# EAGLE design IN17BOARD (EAGLE 7.1.0)
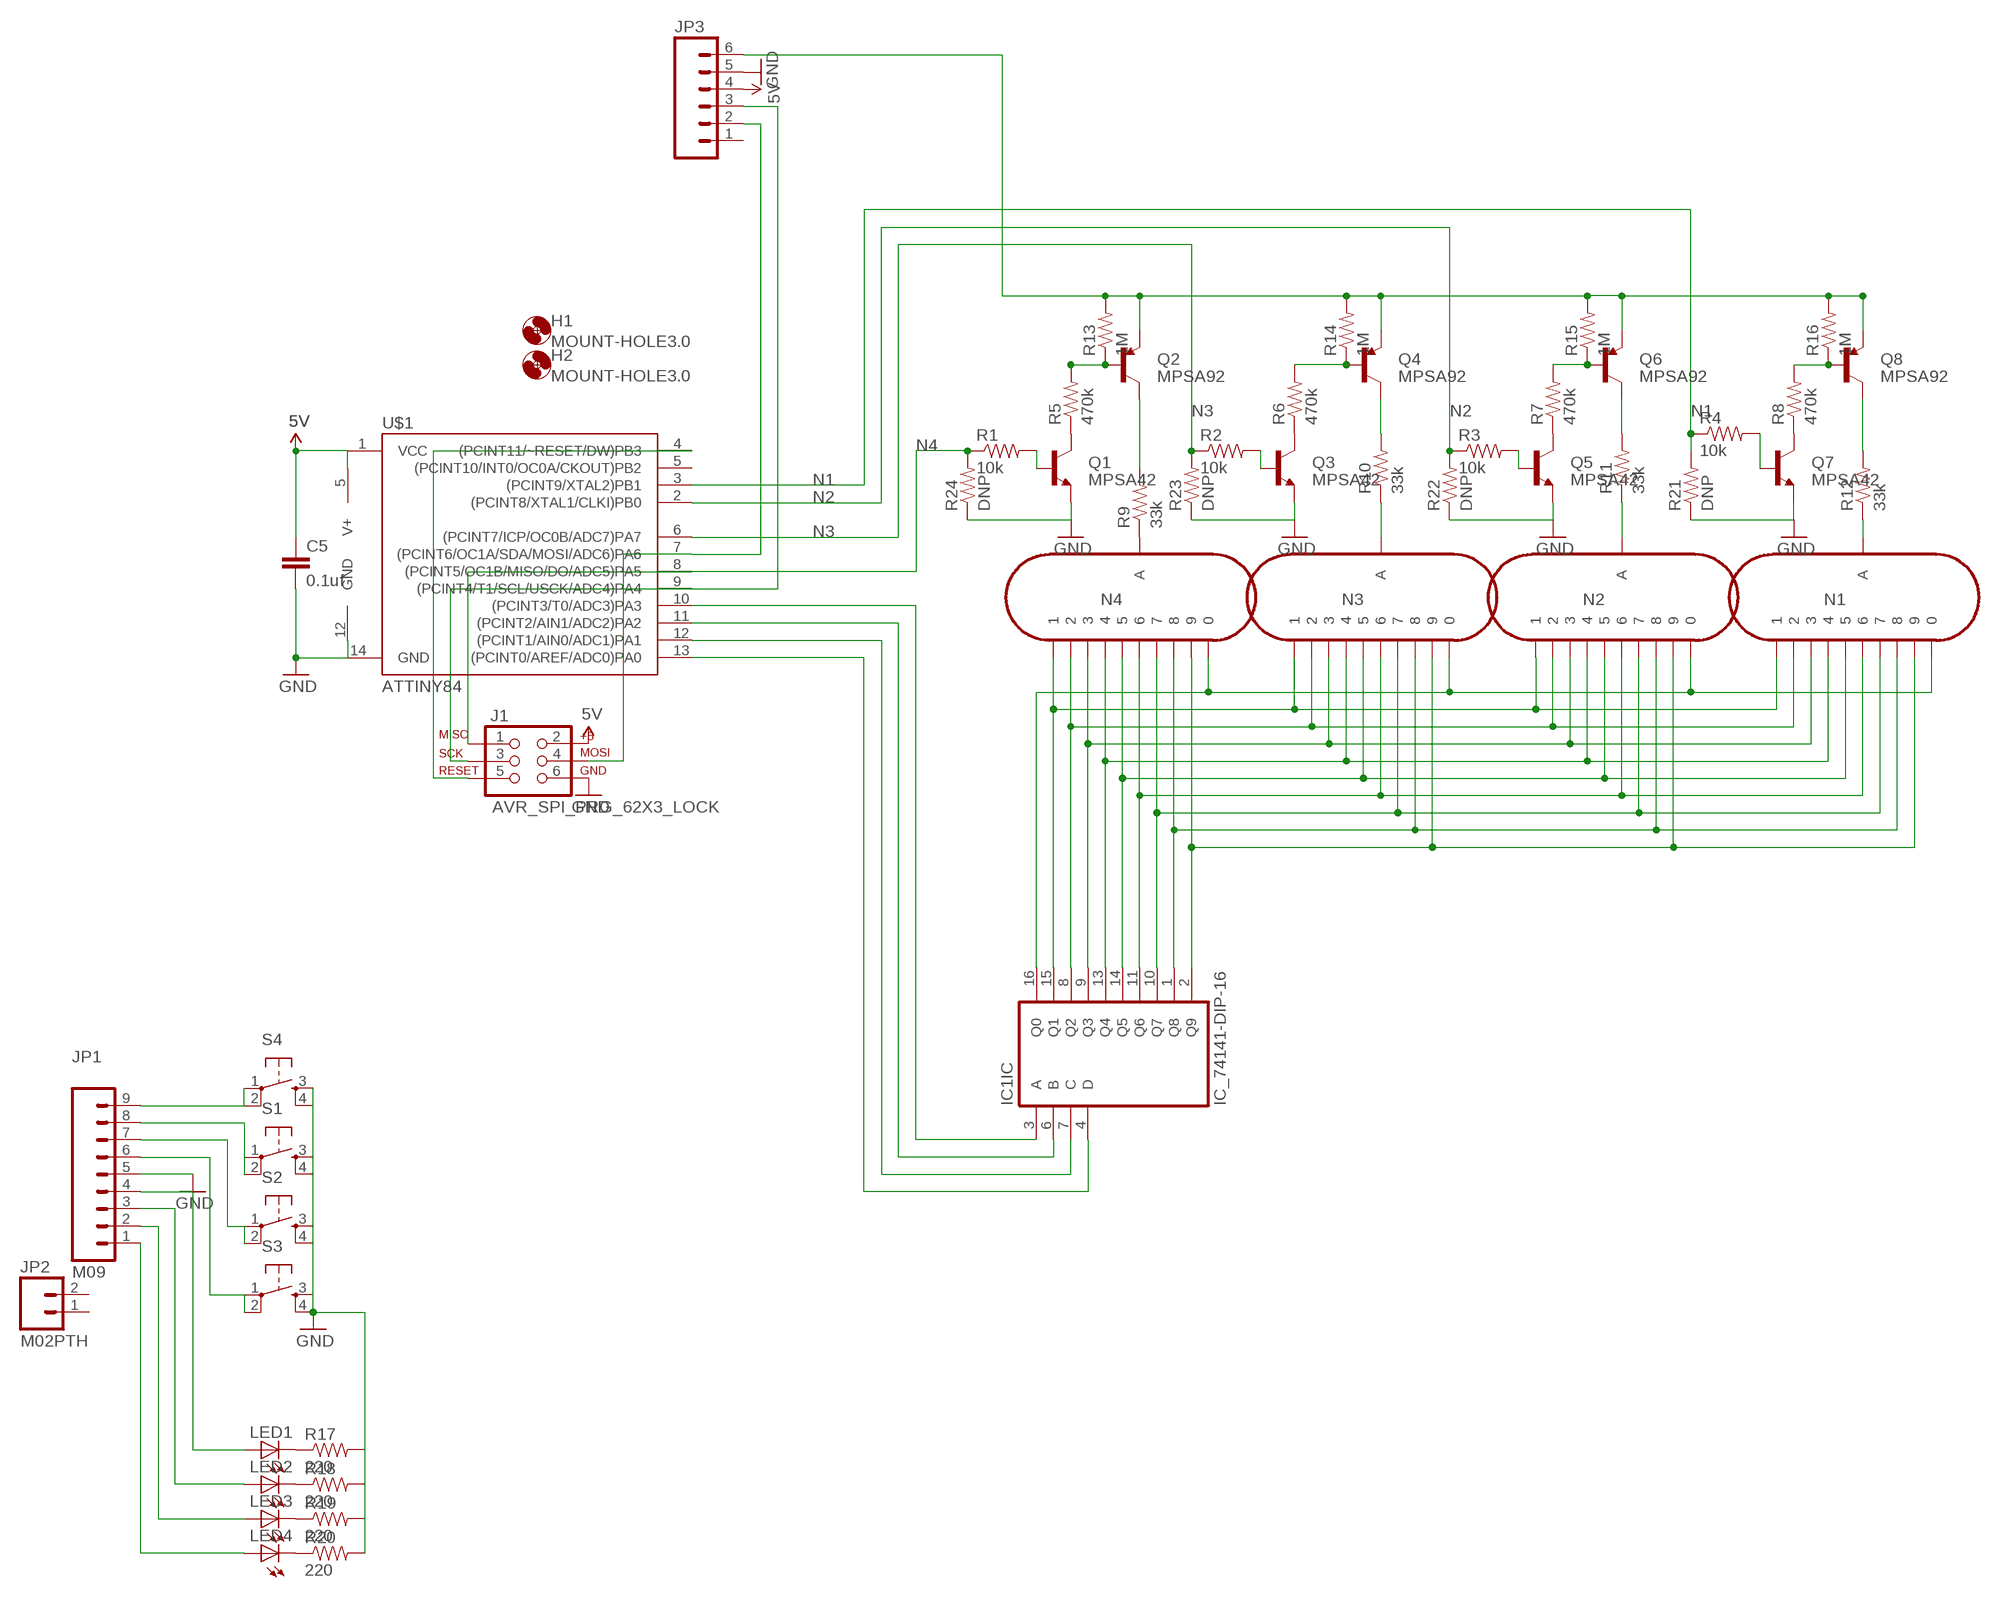
[diagram p0: schematic, sheet 1]

## Parts
C5  0.1uf  CAP0805  [0805]
H1  MOUNT-HOLE3.0  [3,0]
H2  MOUNT-HOLE3.0  [3,0]
IC1  IC_74141-DIP-16  [DIL16]
J1  AVR_SPI_PRG_62X3_LOCK  [2X3_LOCK]
JP1  M09  [1X09]
JP2  M02PTH  [1X02]
JP3  M06SIP  [1X06]
LED1  LED0603  [LED-0603]
LED2  LED0603  [LED-0603]
LED3  LED0603  [LED-0603]
LED4  LED0603  [LED-0603]
N1  IN-17  [IN-17]
N2  IN-17  [IN-17]
N3  IN-17  [IN-17]
N4  IN-17  [IN-17]
Q1  MPSA42  TRANSISTOR_NPNMPSA42  [SOT23]
Q2  MPSA92  TRANSISTOR_PNPMMBT3906  [SOT23]
Q3  MPSA42  TRANSISTOR_NPNMPSA42  [SOT23]
Q4  MPSA92  TRANSISTOR_PNPMMBT3906  [SOT23]
Q5  MPSA42  TRANSISTOR_NPNMPSA42  [SOT23]
Q6  MPSA92  TRANSISTOR_PNPMMBT3906  [SOT23]
Q7  MPSA42  TRANSISTOR_NPNMPSA42  [SOT23]
Q8  MPSA92  TRANSISTOR_PNPMMBT3906  [SOT23]
R1  10k  RESISTOR0805-RES  [0805]
R2  10k  RESISTOR0805-RES  [0805]
R3  10k  RESISTOR0805-RES  [0805]
R4  10k  RESISTOR0805-RES  [0805]
R5  470k  RESISTOR0805-RES  [0805]
R6  470k  RESISTOR0805-RES  [0805]
R7  470k  RESISTOR0805-RES  [0805]
R8  470k  RESISTOR0805-RES  [0805]
R9  33k  RESISTOR0805-RES  [0805]
R10  33k  RESISTOR0805-RES  [0805]
R11  33k  RESISTOR0805-RES  [0805]
R12  33k  RESISTOR0805-RES  [0805]
R13  1M  RESISTOR0805-RES  [0805]
R14  1M  RESISTOR0805-RES  [0805]
R15  1M  RESISTOR0805-RES  [0805]
R16  1M  RESISTOR0805-RES  [0805]
R17  220  RESISTOR0603-RES  [0603-RES]
R18  220  RESISTOR0603-RES  [0603-RES]
R19  220  RESISTOR0603-RES  [0603-RES]
R20  220  RESISTOR0603-RES  [0603-RES]
R21  DNP  RESISTOR0805-RES  [0805]
R22  DNP  RESISTOR0805-RES  [0805]
R23  DNP  RESISTOR0805-RES  [0805]
R24  DNP  RESISTOR0805-RES  [0805]
S1  TAC_SWITCHPTH  [TACTILE-PTH]
S2  TAC_SWITCHPTH  [TACTILE-PTH]
S3  TAC_SWITCHPTH  [TACTILE-PTH]
S4  TAC_SWITCHPTH  [TACTILE-PTH]
U$1  ATTINY84  [SO14]

## Nets
0: IC1.16(IC:Q0) N1.0 N2.0 N3.0 N4.0
1: IC1.15(IC:Q1) N1.1 N2.1 N3.1 N4.1
2: IC1.8(IC:Q2) N1.2 N2.2 N3.2 N4.2
3: IC1.9(IC:Q3) N1.3 N2.3 N3.3 N4.3
4: IC1.13(IC:Q4) N1.4 N2.4 N3.4 N4.4
5: IC1.14(IC:Q5) N1.5 N2.5 N3.5 N4.5
5V: C5.1 IC1.5(SUPPLY:V+) J1.2 JP3.4 U$1.1(VCC)
6: IC1.11(IC:Q6) N1.6 N2.6 N3.6 N4.6
7: IC1.10(IC:Q7) N1.7 N2.7 N3.7 N4.7
8: IC1.1(IC:Q8) N1.8 N2.8 N3.8 N4.8
9: IC1.2(IC:Q9) N1.9 N2.9 N3.9 N4.9
A: IC1.3(IC:A) U$1.10((PCINT3/T0/ADC3)PA3)
B: IC1.6(IC:B) U$1.11((PCINT2/AIN1/ADC2)PA2)
C: IC1.7(IC:C) U$1.12((PCINT1/AIN0/ADC1)PA1)
D: IC1.4(IC:D) U$1.13((PCINT0/AREF/ADC0)PA0)
GND: C5.2 IC1.12(SUPPLY:GND) J1.6 JP1.5 JP3.5 Q1.2(E) Q3.2(E) Q5.2(E) Q7.2(E) R17.2 R18.2 R19.2 R20.2 R21.1 R22.1 R23.1 R24.1 S1.3 S1.4 S2.3 S2.4 S3.3 S3.4 S4.3 S4.4 U$1.14(GND)
N1: R4.1 R21.2 U$1.3((PCINT9/XTAL2)PB1)
N2: R3.1 R22.2 U$1.2((PCINT8/XTAL1/CLKI)PB0)
N3: R2.1 R23.2 U$1.6((PCINT7/ICP/OC0B/ADC7)PA7)
N4: J1.1 R1.1 R24.2 U$1.8((PCINT5/OC1B/MISO/DO/ADC5)PA5)
N$3: J1.5 U$1.4((PCINT11/~RESET/DW)PB3)
N$11: Q1.1(B) R1.2
N$12: Q3.1(B) R2.2
N$13: Q5.1(B) R3.2
N$14: Q7.1(B) R4.2
N$15: Q1.3(C) R5.1
N$16: Q3.3(C) R6.1
N$17: Q5.3(C) R7.1
N$18: Q7.3(C) R8.1
N$19: Q2.1(B) R5.2 R13.1
N$20: Q4.1(B) R6.2 R14.1
N$21: Q6.1(B) R7.2 R15.1
N$22: Q8.1(B) R8.2 R16.1
N$23: JP3.6 Q2.2(E) Q4.2(E) Q6.2(E) Q8.2(E) R13.2 R14.2 R15.2 R16.2
N$24: N4.A R9.1
N$25: N3.A R10.1
N$26: N2.A R11.1
N$27: N1.A R12.1
N$28: Q2.3(C) R9.2
N$29: Q4.3(C) R10.2
N$30: Q6.3(C) R11.2
N$31: Q8.3(C) R12.2
N$42: LED1.C R17.1
N$43: LED2.C R18.1
N$44: LED3.C R19.1
N$45: JP1.9 S4.1 S4.2
N$46: JP1.8 S1.1 S1.2
N$47: JP1.7 S2.1 S2.2
N$48: JP1.6 S3.2
N$49: LED4.C R20.1
N$50: JP1.4 LED1.A
N$51: JP1.3 LED2.A
N$52: JP1.2 LED3.A
N$53: JP1.1 LED4.A
SCL: J1.3 JP3.3 U$1.9((PCINT4/T1/SCL/USCK/ADC4)PA4)
SDA: J1.4 JP3.2 U$1.7((PCINT6/OC1A/SDA/MOSI/ADC6)PA6)
Unconnected: JP2.1 JP2.2 JP3.1 S3.1 U$1.5((PCINT10/INT0/OC0A/CKOUT)PB2)

## Library data of the parts
C5 = SparkFun-Capacitors:CAP: Capacitor Standard 0603 ceramic capacitor, and 0.1" leaded capacitor.
H1 H2 = holes:MOUNT-HOLE: MOUNTING HOLE with drill center marker
IC1 = dp_devices:IC_74141: BCD to decimal decoder
J1 = SparkFun-Connectors:AVR_SPI_PRG_6: AVR ISP 6 Pin This is the reduced ISP connector for AVR programming. Common on Arduino. This footprint will take up less PCB space and can be used with a 10-pin to 6-pin adapter such as SKU: BOB-08508
JP1 = SparkFun-Connectors:M09: Header 9 Standard 9-pin 0.1" header. Use with straight break away headers (SKU : PRT-00116), right angle break away headers (PRT-00553), swiss pins (PRT-00743), machine pins (PRT-00117), and female headers (PRT-00115).
JP2 = SparkFun-Connectors:M02: Standard 2-pin 0.1" header. Use with - straight break away headers ( PRT-00116) - right angle break away headers (PRT-00553) - swiss pins (PRT-00743) - machine pins (PRT-00117) - female headers (PRT-00115) Molex polarized connector foot print use with: PRT-08233 with associated crimp pins and housings. 2.54_SCREWTERM for use with PRT-10571. 3.5mm Screw Terminal footprints for PRT-08084 5mm Screw Terminal footprints for use with PRT-08433
JP3 = SparkFun-Connectors:M06: Header 6 Standard 6-pin 0.1" header. Use with straight break away headers (SKU : PRT-00116), right angle break away headers (PRT-00553), swiss pins (PRT-00743), machine pins (PRT-00117), and female headers (PRT-00115). Molex polarized connector foot print use with SKU : PRT-08094 with associated crimp pins and housings. NOTES ON THE VARIANTS LOCK and LOCK_LONGPADS... This footprint was designed to help hold the alignment of a through-hole component (i.e. 6-pin header) while soldering it into place. You may notice that each hole has been shifted either up or down by 0.005 of an inch from it's more standard position (which is a perfectly straight line). This slight alteration caused the pins (the squares in the middle) to touch the edges of the holes. Because they are alternating, it causes a "brace" to hold the component in place. 0.005 has proven to be the perfect amount of "off-center" position when using our standard breakaway headers. Although looks a little odd when you look at the bare footprint, once you have a header in there, the alteration is very hard to notice. Also,if you push a header all the way into place, it is covered up entirely on the bottom side. This idea of altering the position of holes to aid alignment will be further integrated into the Sparkfun Library for other footprints. It can help hold any component with 3 or more connection pins.
LED1-LED4 = SparkFun-LED:LED: LEDs Standard schematic elements and footprints for 5mm, 3mm, 1206, and 0603 sized LEDs. 5mm - Spark Fun Electronics SKU : COM-00529 (and others)
N1-N4 = russian-nixies:IN-17: IN-17: tiny numeric topview nixie tube
Q1 Q3 Q5 Q7 = SparkFun-DiscreteSemi:TRANSISTOR_NPN: Generic NPN BJT MMBT2222A - TRANS-08049 (SOT-23, 1A 40V) MPSA42 - TRANS-09116 (SOT-23, 500mA 300V) MMBT5088LT1G - TRANS-11160 (SOT-23, 50 mA 30V); PROD_ID: TRANS-09116
Q2 Q4 Q6 Q8 = SparkFun-DiscreteSemi:TRANSISTOR_PNP: Generic PNP BJT Double check pinouts against datasheets- not all devices are the same! MMBT3906 - 40V 200mA SOT-23 (TRANS-08052) MMBT4403 - 40V 600mA SOT-23 (TRANS-09245); PROD_ID: TRANS-08052; VALUE: MMBT3906
R1-R24 = SparkFun-Resistors:RESISTOR: Resistor Basic schematic elements and footprints for 0603, 1206, and PTH resistors.
S1-S4 = SparkFun-Electromechanical:TAC_SWITCH: Momentary Switch Button commonly used for reset or general input. Spark Fun Electronics SKU : COM-00097 SMT- SWCH-08247
U$1 = SparkFun-DigitalIC:ATTINY84: Atmel 14-pin 2/4/8kB flash uC

## Net classes
0 default: width 0.254 mm

## Board
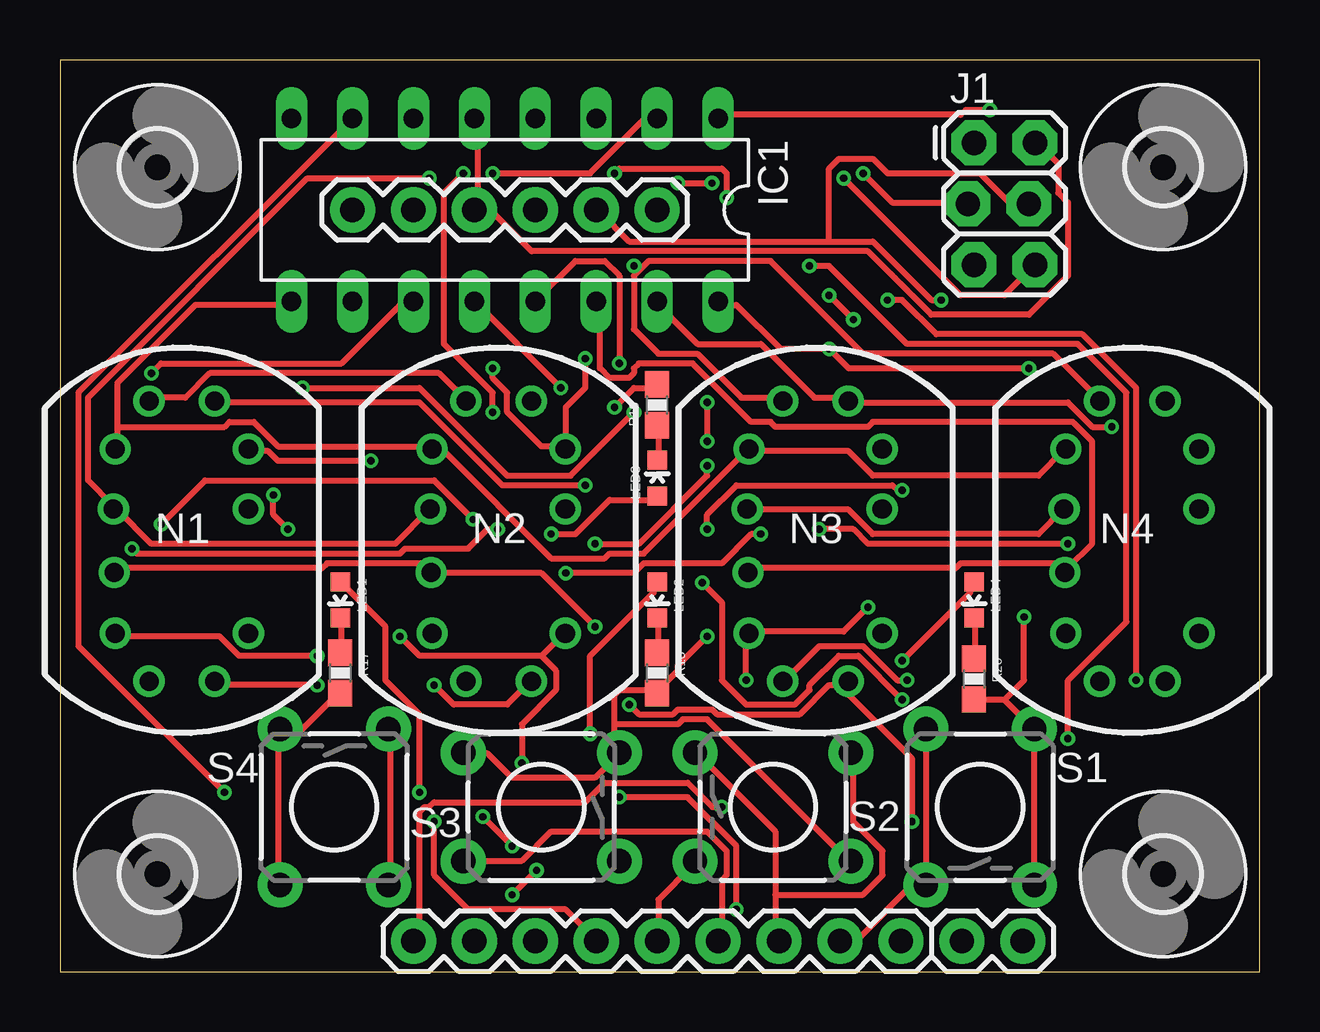
[diagram p1: board, top side]
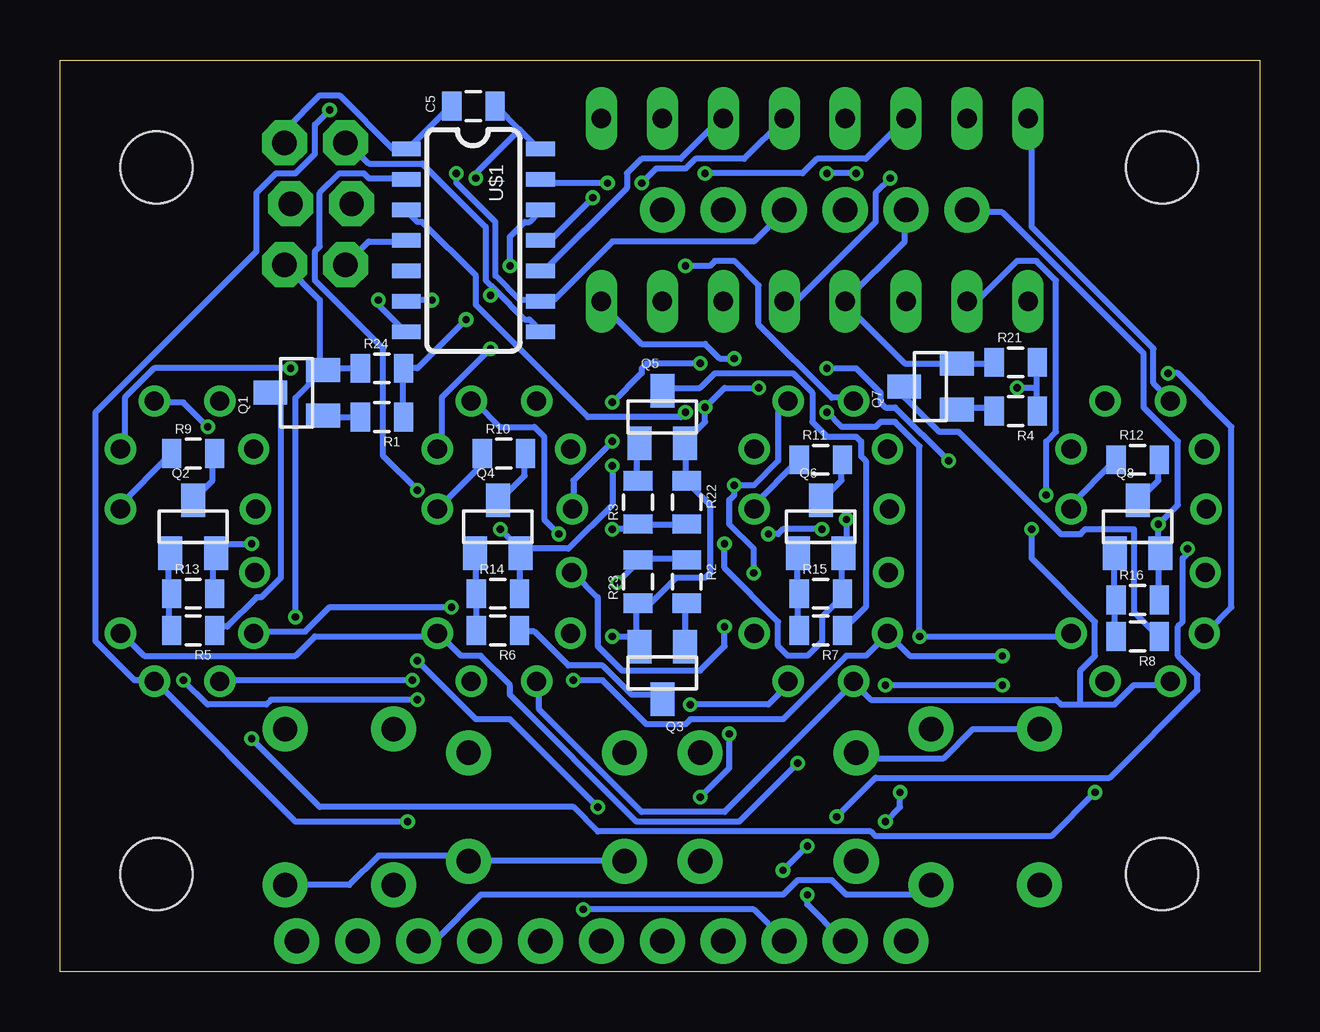
[diagram p2: board, bottom side, seen from below]

Size 50 x 38 mm. Coordinates in mm from the lower left corner, seen from the top.
Outline: 0,0 50,0 50,38 0,38 0,0
Copper layers (1*16): Top 0.035mm / dielectric 1.5mm / Bottom 0.035mm
Design rules "SeeedStudio_2layer_DRU_no_angle_20140221": minimum track width 6mil, minimum drill 12mil, track to track 6mil, track to pad 6mil, pad to pad 6mil, via to via 6mil, smd to smd 0mil, copper to edge 10mil, drill to drill 10mil, minimum pad ring 10mil, minimum via ring 6mil, stop-mask expansion 2mil, vias tented up to drill 100mil, thermal gap 10mil

### Footprints (pad centres in the part's own frame; a part is rotated, then mirrored left to right if it is on the bottom)
0805 = smd 0.8 x 1.2: 1 -0.9,0; 2 0.9,0
3,0 = hole 3: 0,0
DIL16 = drill 0.813 long: 1 -8.89,-3.81; 2 -6.35,-3.81; 3 -3.81,-3.81; 4 -1.27,-3.81; 5 1.27,-3.81; 6 3.81,-3.81; 7 6.35,-3.81; 8 8.89,-3.81; 9 8.89,3.81; 10 6.35,3.81; 11 3.81,3.81; 12 1.27,3.81; 13 -1.27,3.81; 14 -3.81,3.81; 15 -6.35,3.81; 16 -8.89,3.81
2X3_LOCK = drill 1.016 pad 1.88 octagon: 1 0,0; 2 0,2.54; 3 2.54,-0.254; 4 2.54,2.286; 5 5.08,0; 6 5.08,2.54
1X09 = drill 1.016 pad 1.88: 1 0,0; 2 2.54,0; 3 5.08,0; 4 7.62,0; 5 10.16,0; 6 12.7,0; 7 15.24,0; 8 17.78,0; 9 20.32,0
1X02 = drill 1.016 pad 1.88: 1 0,0; 2 2.54,0
1X06 = drill 1.016 pad 1.88: 1 0,0; 2 2.54,0; 3 5.08,0; 4 7.62,0; 5 10.16,0; 6 12.7,0
LED-0603 = smd 0.8 x 0.8: A 0,-0.75; C 0,0.75
IN-17 = drill 0.8: 0 2.777,4; 1 1.365,6; 2 -1.365,6; 3 -2.778,4; 4 -2.858,1.5; 5 -2.818,-1.143; 6 -2.778,-3.683; 7 -1.365,-5.683; 8 1.365,-5.683; 9 2.777,-3.683; A 2.777,1.5
SOT23 = smd 1 x 1.4: 1 -0.95,-1.1; 2 0.95,-1.1; 3 0,1.1
0603-RES = smd 1.1 x 1: 1 -0.85,0; 2 0.85,0
TACTILE-PTH = drill 1.016 pad 1.88: 1 -3.251,2.261; 2 3.251,2.261; 3 -3.251,-2.261; 4 3.251,-2.261
SO14 = smd 0.6 x 1.2: 1 -3.81,-2.8; 2 -2.54,-2.8; 3 -1.27,-2.8; 4 0,-2.8; 5 1.27,-2.8; 6 2.54,-2.8; 7 3.81,-2.8; 8 3.81,2.8; 9 2.54,2.8; 10 1.27,2.8; 11 0,2.8; 12 -1.27,2.8; 13 -2.54,2.8; 14 -3.81,2.8

### Placement (x,y rotation side)
C5  32.77,36.07 0 bottom
H1  4.06,33.53 0 top
H2  45.97,4.06 0 top
H3  MOUNT-HOLE3.0  [3,0]  4.06,4.06 0 top
H4  MOUNT-HOLE3.0  [3,0]  45.97,33.53 0 top
IC1  18.54,31.75 180 top
J1  38.1,34.54 270 top
JP1  14.73,1.27 0 top
JP2  37.59,1.27 0 top
JP3  24.89,31.75 180 top
LED1  11.68,15.49 180 top
LED2  24.89,15.49 180 top
LED3  24.89,20.57 0 top
LED4  38.1,15.49 180 top
N1  5.08,17.78 0 top
N2  18.29,17.78 0 top
N3  31.5,17.78 0 top
N4  44.7,17.78 0 top
Q1  40.13,24.13 90 bottom
Q2  44.45,18.54 0 bottom
Q3  24.89,12.45 180 bottom
Q4  31.75,18.54 0 bottom
Q5  24.89,23.11 0 bottom
Q6  18.29,18.54 0 bottom
Q7  13.72,24.38 90 bottom
Q8  5.08,18.54 0 bottom
R1  36.58,23.11 180 bottom
R2  23.88,16.26 270 bottom
R3  25.91,19.56 90 bottom
R4  10.16,23.37 180 bottom
R5  44.45,14.22 180 bottom
R6  31.75,14.22 180 bottom
R7  18.29,14.22 180 bottom
R8  5.08,13.97 180 bottom
R9  44.45,21.59 0 bottom
R10  31.5,21.59 0 bottom
R11  18.29,21.34 0 bottom
R12  5.08,21.34 0 bottom
R13  44.45,15.75 0 bottom
R14  31.75,15.75 0 bottom
R15  18.29,15.75 0 bottom
R16  5.08,15.49 0 bottom
R17  11.68,12.45 270 top
R18  24.89,12.45 270 top
R19  24.89,23.62 90 top
R20  38.1,12.19 270 top
R21  10.16,25.4 0 bottom
R22  23.88,19.56 270 bottom
R23  25.91,16.26 90 bottom
R24  36.58,25.15 0 bottom
S1  38.35,6.86 90 top
S2  29.72,6.86 0 top
S3  20.07,6.86 180 top
S4  11.43,6.86 270 top
U$1  32.77,30.48 270 bottom

### Tracks (layer width: path | path; a pad name or v marks a point on that pad's centre or on a via)
0  (via drill 0.3)
  Top 0.254: v12.95,21.29 9.09,21.29 8.69,21.69 7.87,21.69 N1.0 | v18.03,25.15 18.03,24.74 18.64,24.13 18.64,23.32 20.07,21.89 20.88,21.89 N2.0 21.08,21.89 21.08,23.52 21.89,24.33 v21.89,25.55 | IC1.16 27.58,27.79 28.19,27.79 30.02,25.96 v32.05,25.96 32.87,25.15 v40.39,25.15
  Bottom 0.254: v12.95,21.29 15.19,23.52 15.6,23.52 15.8,23.72 15.8,24.13 16.82,25.15 v18.03,25.15 | v32.05,25.96 34.09,23.93 34.09,21.89 N3.0 | v40.39,25.15 46.08,25.15 47.3,23.93 47.3,21.89 N4.0 | v21.89,25.55 22.5,25.55 23.11,26.16 25.76,26.16 27.38,27.79 IC1.16
1  (via drill 0.3)
  Top 0.254: v21.89,20.27 18.44,20.27 14.99,23.72 6.45,23.72 N1.1 | IC1.15 24.94,27.79 26.57,26.16 29.21,26.16 31.45,23.93 32.66,23.93 N3.1 32.87,23.72 42.01,23.72 43.03,22.71 v43.84,22.71 | v21.08,16.61 23.93,16.61 24.33,17.02 27.58,17.02 28.8,18.24 v29.21,18.24
  Bottom 0.254: N2.1 19.66,23.72 20.07,23.32 20.07,21.29 21.08,20.27 v21.89,20.27 21.89,19.86 22.1,19.66 22.1,18.64 21.08,17.63 v21.08,16.61 | v43.84,22.71 44.86,23.72 45.87,23.72 N4.1 | v29.21,18.24 29.82,18.85 29.82,22.3 30.23,22.71 31.65,22.71 32.66,23.72 N3.1
2  (via drill 0.3)
  Top 0.254: 24.13,29.21 24.54,29.62 29.62,29.62 33.48,25.76 41.4,25.76 43.23,23.93 N4.2 | 24.13,29.21 23.93,29.01 23.93,26.77 24.94,25.76 26.57,25.76 28.4,23.93 30.02,23.93 N3.2 | N1.2 3.81,23.93 5.23,23.93 6.25,24.94 15.8,24.94 16.82,23.93 N2.2 | v23.93,29.41 24.13,29.21
  Bottom 0.254: IC1.8 9.5,35.51 9.5,31.04 4.42,25.96 4.42,24.54 3.81,23.93 N1.2 | v23.93,29.41 22.91,29.41 22.71,29.62 21.89,29.62 20.88,28.6 20.88,26.98 17.83,23.93 17.02,23.93 N2.2
3
  Top 0.254: N4.3 41.81,21.69 40.79,20.68 33.88,20.68 32.87,21.69 28.8,21.69 N3.3 28.6,21.69 24.33,17.42 22.91,17.42 22.71,17.22 20.47,17.22 16,21.69 15.6,21.69 N2.3 15.39,21.89 9.09,21.89 8.08,22.91 7.06,22.91 6.86,22.71 2.39,22.71 | 2.39,22.71 2.39,24.54 5.64,27.79 9.5,27.79 IC1.9 | 2.39,22.71 2.39,21.89 N1.3
4  (via drill 0.3)
  Top 0.254: N3.4 28.8,19.25 32.87,19.25 33.88,18.24 40.79,18.24 41.81,19.25 N4.4 | N2.4 15.39,19.25 13.97,17.83 3.81,17.83 2.39,19.25 N1.4 2.18,19.46 1.17,20.47 1.17,23.93 10.31,33.07 v15.39,33.07 | v26.98,23.72 v26.98,22.1 | v23.32,25.35 23.32,29.01 22.71,29.62 21.49,29.62 IC1.13
  Bottom 0.254: v15.39,33.07 16,32.46 16,31.24 19.25,27.99 19.66,27.99 IC1.13 | v26.98,22.1 28.6,20.47 28.6,19.46 N3.4 | v26.98,23.72 25.76,24.94 25.76,25.15 25.55,25.35 v23.32,25.35
5  (via drill 0.3)
  Top 0.254: N1.5 2.39,16.82 10.92,16.82 11.12,17.02 15.19,17.02 15.39,16.82 N2.5 15.6,16.61 20.07,16.61 v22.3,14.38 | N3.5 28.8,16.82 37.34,16.82 37.54,17.02 41.6,17.02 41.81,16.82 N4.5 42.01,16.82 43.03,17.83 43.03,22.1 42.22,22.91 33.88,22.91 33.68,22.71 29.82,22.71 29.62,22.91 28.8,22.91 26.36,25.35 24.13,25.35 23.93,25.15 23.93,24.94 23.72,24.74 22.91,24.74 22.5,25.15 22.5,27.79 IC1.14
  Bottom 0.254: v22.3,14.38 22.3,13.56 23.32,12.55 26.57,12.55 27.58,13.56 27.58,15.6 28.6,16.61 N3.5
5V
  Top 0.254: IC1.5 17.42,35.51 17.42,31.85 JP3.4 17.42,31.65 18.03,31.65 19.66,30.02 33.68,30.02 36.32,27.38 40.39,27.38 42.01,29.01 42.01,32.05 41.6,32.46 41.6,33.68 40.79,34.49 J1.2
  Bottom 0.254: C5.1 33.68,36.12 35.51,34.29 U$1.1 36.12,34.29 38.35,36.52 39.17,36.52 40.59,35.1 40.59,34.7 J1.2
6  (via drill 0.3)
  Top 0.254: v33.68,15.19 32.66,14.17 28.8,14.17 N3.6 28.6,13.97 v28.6,12.14 | v10.72,13.16 7.47,13.16 6.66,13.97 2.39,13.97 N1.6 | v3.81,24.94 4.22,25.35 11.73,25.35 14.17,27.79 14.58,27.79 IC1.11
  Bottom 0.254: v33.68,15.19 38.76,15.19 39.78,14.17 41.81,14.17 N4.6 | v10.72,13.16 14.58,13.16 15.39,13.97 N2.6 15.6,13.97 16.41,13.16 17.22,13.16 19.86,10.52 23.72,10.52 23.93,10.31 25.55,10.31 27.38,12.14 v28.6,12.14 | v3.81,24.94 3.4,24.94 1.17,22.71 1.17,15.19 2.18,14.17 N1.6
7  (via drill 0.3)
  Top 0.254: v35.31,12.14 34.9,12.14 33.48,13.56 31.65,13.56 30.23,12.14 N3.7 | v8.89,19.86 8.89,19.05 v9.5,18.44
  Bottom 0.254: 7.47,11.12 8.28,11.12 8.48,11.33 16.2,11.33 16.82,11.94 N2.7 17.02,11.94 22.3,6.66 25.76,6.66 30.02,10.92 30.02,11.94 N3.7 | 7.47,11.12 6.04,11.12 5.23,11.94 3.81,11.94 N1.7 | v35.31,12.14 43.23,12.14 N4.7 | v8.89,19.86 8.89,22.1 8.48,22.5 8.48,28.8 9.3,29.62 10.11,29.62 11.73,27.99 12.14,27.99 IC1.10 | v9.5,18.44 9.5,17.22 6.86,14.58 6.86,13.16 7.47,12.55 7.47,11.12
8  (via drill 0.3)
  Top 0.254: v10.72,11.94 6.45,11.94 N1.8 | v15.6,11.94 16.41,11.12 18.64,11.12 19.46,11.94 N2.8 | 32.46,11.94 32.05,11.94 30.84,10.72 27.38,10.72 27.18,10.92 25.76,10.92 25.55,10.72 24.13,10.72 v23.72,11.12 | 32.46,11.94 32.66,11.94 N3.8 32.46,11.94 | v35.51,6.25 35.51,8.89 32.46,11.94 | v38.76,35.92 37.74,35.92 37.54,35.71 27.58,35.71 IC1.1
  Bottom 0.254: v15.6,11.94 v10.72,11.94 | v23.72,11.12 20.47,11.12 19.66,11.94 N2.8 | v35.51,6.25 40.18,6.25 45.87,11.94 N4.8 46.08,12.14 46.89,12.14 48.51,13.77 48.51,23.32 41.81,30.02 41.81,32.46 41,33.27 40.18,33.27 39.37,34.09 39.37,35.31 v38.76,35.92
9  (via drill 0.3)
  Top 0.254: v14.17,13.97 14.99,13.16 20.07,13.16 | 20.07,13.16 20.88,13.97 N2.9 | v18.03,33.27 22.1,33.27 24.33,35.51 24.74,35.51 IC1.2 | v16.82,33.27 16,32.46 16,26.16 18.03,24.13 v18.03,23.32 | v19.25,8.69 19.25,10.31 20.68,11.73 20.68,12.55 20.07,13.16
  Bottom 0.254: N4.9 47.3,13.97 46.48,13.16 40.18,13.16 39.37,13.97 34.29,13.97 N3.9 34.09,13.97 33.27,13.16 32.46,13.16 31.24,11.94 31.24,11.53 25.96,6.25 21.69,6.25 v19.25,8.69 | N1.9 7.87,13.97 v14.17,13.97 14.17,21.89 15.19,22.91 15.8,22.91 16,22.71 17.42,22.71 v18.03,23.32 | v16.82,33.27 v18.03,33.27
A
  Bottom 0.254: U$1.10 29.82,29.21 26.36,32.66 26.36,33.27 25.76,33.88 24.13,33.88 22.5,35.51 IC1.3
B  (via drill 0.3)
  Top 0.254: v27.79,32.26 27.79,33.27 27.58,33.48 23.32,33.48 v23.11,33.27
  Bottom 0.254: v27.79,32.26 29.41,30.63 29.82,30.63 U$1.11 | v23.11,33.27 19.05,33.27 18.44,33.88 16.41,33.88 IC1.6
C  (via drill 0.3)
  Top 0.254: v31.24,29.41 32.05,29.41 35.31,26.16 42.42,26.16 44.45,24.13 44.45,14.58 42.01,12.14 v42.01,9.7 | v6.86,7.47 0.76,13.56 0.76,24.13 IC1.7
  Bottom 0.254: v31.24,29.41 31.24,30.63 30.63,31.24 30.43,31.24 30.02,31.65 U$1.12 | v42.01,9.7 39.17,6.86 28.6,6.86 27.58,5.84 16.2,5.84 16,5.64 8.69,5.64 v6.86,7.47
D  (via drill 0.3)
  Top 0.254: v25.76,32.87 v27.18,32.87
  Bottom 0.254: v27.18,32.87 29.82,32.87 U$1.13 | v25.76,32.87 25.15,33.48 23.93,33.48 23.52,33.88 21.49,33.88 IC1.4
GND  (via drill 0.3)
  Top 0.254: R17.2 11.53,11.53 10.11,10.11 S4.3 9.09,10.11 9.09,3.61 S4.4 | v23.11,23.52 23.93,24.33 24.74,24.33 R19.2 | 23.11,10.31 23.11,9.5 23.32,9.3 S3.3 23.32,9.09 22.3,8.08 18.85,8.08 17.83,9.09 16.82,9.09 S3.4 | 23.11,10.31 23.11,11.53 23.32,11.73 24.74,11.73 R18.2 24.94,11.73 25.76,12.55 25.76,12.75 v26.98,13.97 | v20.88,24.33 IC1.12 | v32.66,33.07 37.54,28.19 39.37,28.19 J1.6 | 39.37,11.33 38.15,11.33 R20.2 | 40.59,10.11 39.37,11.33 | 40.59,10.11 40.59,3.61 S1.3 | 40.59,10.11 S1.4 | JP1.5 24.94,1.37 24.94,3 26.36,4.42 S2.3 | v40.18,14.78 40.18,12.14 39.37,11.33 | 23.11,10.31 25.76,10.31 25.96,10.52 26.98,10.52 32.87,4.62 S2.4
  Bottom 0.254: R21.1 11.12,25.35 12.55,25.35 Q7.2 12.75,25.35 14.78,25.35 17.22,27.79 IC1.12 14.78,30.43 14.78,31.65 JP3.5 | 25.96,13.97 25.96,13.56 Q3.2 25.96,13.97 | 25.96,13.97 25.96,15.19 R23.1 25.76,15.39 25.35,15.39 24.33,16.41 23.11,16.41 22.91,16.61 22.91,19.46 23.72,20.27 R22.1 23.93,20.47 23.93,21.89 Q5.2 23.93,22.1 23.11,22.91 v23.11,23.52 22.3,24.33 v20.88,24.33 | v26.98,13.97 25.96,13.97 | S4.3 11.94,10.11 13.16,8.89 16.61,8.89 16.82,9.09 S3.4 | 30.84,35.1 31.85,36.12 C5.2 | 30.84,35.1 30.02,34.29 U$1.14 | R24.1 38.96,25.15 Q1.2 | J1.6 39.17,27.99 39.17,25.15 Q1.2 | 30.84,35.1 32.66,33.27 v32.66,33.07 | S2.3 26.57,4.62 32.87,4.62 S2.4 33.07,4.62 33.27,4.83 36.73,4.83 37.95,3.61 S1.3 | v40.18,14.78 40.18,23.93 39.17,24.94 Q1.2
N1  (via drill 0.3)
  Top 0.254: v23.93,23.32 21.29,20.68 18.64,20.68 14.99,24.33 v10.11,24.33
  Bottom 0.254: 9.3,24.33 9.3,25.35 R21.2 | 9.3,24.33 9.3,23.52 R4.1 | v23.93,23.32 24.13,23.11 27.99,23.11 32.66,27.79 32.66,29.01 34.9,31.24 35.1,31.24 35.51,31.65 U$1.3 | 9.3,24.33 v10.11,24.33
N2  (via drill 0.3)
  Top 0.254: v35.1,20.07 34.9,20.07 34.7,20.27 28.19,20.27 26.98,19.05 v26.98,18.44
  Bottom 0.254: R22.2 23.93,18.64 25.76,18.64 R3.1 25.96,18.64 26.16,18.44 v26.98,18.44 | v35.1,20.07 36.52,21.49 36.52,25.96 39.37,28.8 39.37,30.02 39.17,30.23 39.17,32.46 38.35,33.27 37.34,33.27 37.13,33.07 35.71,33.07 U$1.2
N3  (via drill 0.3)
  Top 0.254: v34.49,27.99 35.1,27.99 36.52,26.57 42.62,26.57 44.86,24.33 v44.86,12.14 | v35.1,11.33 33.27,13.16 32.46,13.16 31.24,11.94 31.24,11.73 30.63,11.12 28.6,11.12 27.58,12.14 27.58,15.39 v26.77,16.2
  Bottom 0.254: R2.1 23.93,17.22 25.76,17.22 R23.2 25.96,17.02 v26.77,16.2 | v34.49,27.99 35.51,27.99 U$1.6 | v44.86,12.14 43.84,11.12 41.4,11.12 41.2,11.33 v35.1,11.33
N4  (via drill 0.3)
  Top 0.254: v32.05,28.19 v33.07,27.18
  Bottom 0.254: R1.1 35.71,23.11 35.71,25.15 R24.2 35.1,25.15 v33.07,27.18 | 31.85,28.4 32.26,28.8 32.26,31.04 34.9,33.68 37.13,33.68 37.95,34.49 J1.1 | 31.85,28.4 30.63,27.18 30.43,27.18 30.02,26.77 U$1.8 | 31.85,28.4 v32.05,28.19
N$3
  Bottom 0.254: J1.5 37.13,30.43 35.71,30.43 U$1.4
N$11
  Bottom 0.254: R1.2 38.96,23.11 Q1.1
N$12
  Bottom 0.254: R2.2 23.93,15.19 23.93,13.56 Q3.1
N$13
  Bottom 0.254: R3.2 25.96,20.47 25.96,21.89 Q5.1
N$14
  Bottom 0.254: R4.2 11.12,23.52 12.55,23.52 Q7.1
N$15
  Bottom 0.254: R5.1 43.43,14.38 43.03,14.38 41.81,15.6 41.6,15.6 40.79,16.41 40.79,23.72 41.2,24.13 Q1.3
N$16
  Bottom 0.254: R6.1 30.84,14.17 30.23,14.17 28.8,12.75 27.38,12.75 26.16,11.53 24.94,11.53 Q3.3
N$17
  Bottom 0.254: R7.1 17.22,14.38 16.41,15.19 16.41,21.29 16.61,21.49 16.61,22.1 16.82,22.3 18.03,22.3 18.64,22.91 18.64,24.13 19.46,24.94 22.71,24.94 23.32,24.33 24.74,24.33 Q5.3
N$18
  Bottom 0.254: R8.1 4.22,13.97 5.23,14.99 5.23,18.44 7.26,18.44 7.47,18.24 8.28,18.24 12.55,22.5 13.36,22.5 14.78,23.93 14.78,24.33 Q7.3
N$19
  Bottom 0.254: R5.2 45.47,14.38 45.47,15.6 R13.1 45.47,15.8 45.47,17.42 Q2.1
N$20
  Bottom 0.254: R6.2 32.66,14.38 32.66,15.6 R14.1 32.66,15.8 32.66,17.42 Q4.1
N$21
  Bottom 0.254: R7.2 19.25,14.38 19.25,15.6 R15.1 19.25,15.8 19.25,17.42 Q6.1
N$22
  Bottom 0.254: R8.2 6.04,13.97 6.04,15.39 R16.1 6.04,15.6 6.04,17.42 Q8.1
N$23  (via drill 0.3)
  Top 0.254: v31.65,18.44 33.07,18.44 33.68,17.83 v42.01,17.83 | v17.22,18.85 15.6,20.47 6.04,20.47 v4.22,18.64 | v26.98,21.08 26.98,20.68 24.13,17.83 v22.3,17.83
  Bottom 0.254: R14.2 30.84,15.8 30.84,17.42 Q4.2 | R13.2 43.64,15.8 43.64,17.42 Q2.2 43.43,17.63 43.23,17.83 v42.01,17.83 | v31.65,18.44 30.84,17.63 Q4.2 | R16.2 4.22,15.6 4.22,17.42 Q8.2 4.22,17.63 v4.22,18.64 3.4,19.46 3.4,22.1 4.83,23.52 4.83,25.76 10.72,31.65 12.14,31.65 JP3.6 | v17.22,18.85 17.22,17.63 Q6.2 17.42,17.42 17.42,15.8 R15.2 17.42,15.6 18.24,14.78 18.24,13.77 18.85,13.16 19.66,13.16 20.07,13.56 20.07,14.58 22.3,16.82 v22.3,17.83 | v26.98,21.08 26.98,19.46 28.8,17.63 30.63,17.63 Q4.2
N$24
  Bottom 0.254: R9.1 45.47,21.49 47.5,19.46 N4.A
N$25
  Bottom 0.254: R10.1 32.46,21.49 32.46,21.08 34.09,19.46 N3.A
N$26
  Bottom 0.254: R11.1 19.25,21.29 21.08,19.46 N2.A
N$27
  Bottom 0.254: R12.1 6.04,21.29 7.87,19.46 N1.A
N$28
  Bottom 0.254: R9.2 43.64,21.49 43.64,20.47 44.45,19.66 Q2.3
N$29
  Bottom 0.254: R10.2 30.63,21.49 30.63,20.68 31.65,19.66 Q4.3
N$30
  Bottom 0.254: R11.2 17.42,21.29 17.42,20.47 18.24,19.66 Q6.3
N$31
  Bottom 0.254: R12.2 4.22,21.29 4.22,20.47 5.03,19.66 Q8.3
N$42
  Top 0.254: LED1.C 11.73,14.58 11.73,13.36 R17.1
N$43
  Top 0.254: LED2.C 24.94,14.58 24.94,13.36 R18.1
N$44
  Top 0.254: LED3.C 24.94,21.49 24.94,22.71 R19.1
N$45
  Top 0.254: S4.2 13.77,3.61 13.77,10.11 S4.1
  Bottom 0.254: JP1.9 34.9,1.37 34.29,1.37 32.46,3.2 19.86,3.2 19.25,3.81 17.83,3.81 17.22,3.2 14.17,3.2 13.77,3.61 S4.2
N$46
  Top 0.254: JP1.8 32.66,1.37 33.27,1.37 35.51,3.61 S1.1 36.12,3.61 36.12,10.11 S1.2
N$47
  Top 0.254: 29.82,3.2 29.82,5.84 26.57,9.09 S2.1 | 29.82,3.2 29.82,1.37 JP1.7 | 29.82,3.2 33.48,3.2 34.29,4.01 34.29,5.03 33.07,6.25 33.07,9.09 S2.2
N$48
  Top 0.254: JP1.6 27.58,1.37 27.58,3.81 27.79,4.01 27.79,5.03 26.98,5.84 20.47,5.84 19.25,4.62 16.82,4.62 S3.2
N$49
  Top 0.254: LED4.C 38.15,14.58 38.15,13.16 R20.1
N$50  (via drill 0.3)
  Top 0.254: v14.99,7.47 14.99,10.72 13.56,12.14 13.56,14.38 11.73,16.2 LED1.A | v15.6,6.25 15.6,4.01 17.02,2.59 21.08,2.59 22.3,1.37 JP1.4
  Bottom 0.254: v14.99,7.47 14.99,6.86 v15.6,6.25
N$51  (via drill 0.3)
  Top 0.254: v22.1,9.91 22.1,13.16 24.74,15.8 24.74,16.2 LED2.A | v23.32,7.26 26.16,7.26 28.19,5.23 v28.19,2.59
  Bottom 0.254: v22.1,9.91 22.1,8.48 v23.32,7.26 | v28.19,2.59 21.08,2.59 19.86,1.37 JP1.3
N$52  (via drill 0.3)
  Top 0.254: v20.47,18.24 21.49,18.24 22.91,19.66 24.74,19.66 LED3.A | v18.24,18.44 17.83,18.44 17.02,17.63 14.38,17.63 14.17,17.42 3.2,17.42 v3,17.63 | v18.85,5.23 v17.63,6.45 | v18.85,3.2 v19.86,4.22
  Bottom 0.254: v20.47,18.24 20.07,18.24 19.86,18.44 v18.24,18.44 | v3,17.63 3,17.42 3.2,17.22 3.2,14.58 3.4,14.38 3.4,13.16 2.59,12.34 2.59,11.73 6.25,8.08 16,8.08 v17.63,6.45 | v19.86,4.22 v18.85,5.23 | v18.85,3.2 18.85,2.79 17.42,1.37 JP1.2
N$53  (via drill 0.3)
  Top 0.254: v35.1,12.95 37.95,15.8 37.95,16.2 LED4.A | v27.58,6.86 27.18,6.86 26.16,7.87 22.71,7.87 21.89,7.06 15.6,7.06 15.39,6.86 15.19,6.86 14.99,6.66 14.99,1.57 14.78,1.37 JP1.1
  Bottom 0.254: v35.1,12.95 32.66,10.52 31.24,10.52 v27.58,6.86
SCL  (via drill 0.3)
  Top 0.254: v33.48,33.27 34.7,32.05 37.74,32.05 J1.3
  Bottom 0.254: JP3.3 19.86,31.65 21.08,30.43 26.98,30.43 29.41,27.99 29.82,27.99 U$1.9 30.02,27.99 30.84,27.99 31.85,29.01 31.85,31.24 33.48,32.87 v33.48,33.27
SDA  (via drill 0.3)
  Top 0.254: v36.73,27.99 36.32,27.99 33.88,30.43 32.05,30.43 | 32.05,30.43 23.72,30.43 22.5,31.65 JP3.2 | 32.05,30.43 32.05,33.48 32.46,33.88 33.88,33.88 34.49,33.27 38.35,33.27 39.57,32.05 40.39,32.05 J1.4
  Bottom 0.254: v36.73,27.99 36.73,27.79 35.71,26.77 U$1.7